# Altium project PCB_Project.PrjPcb
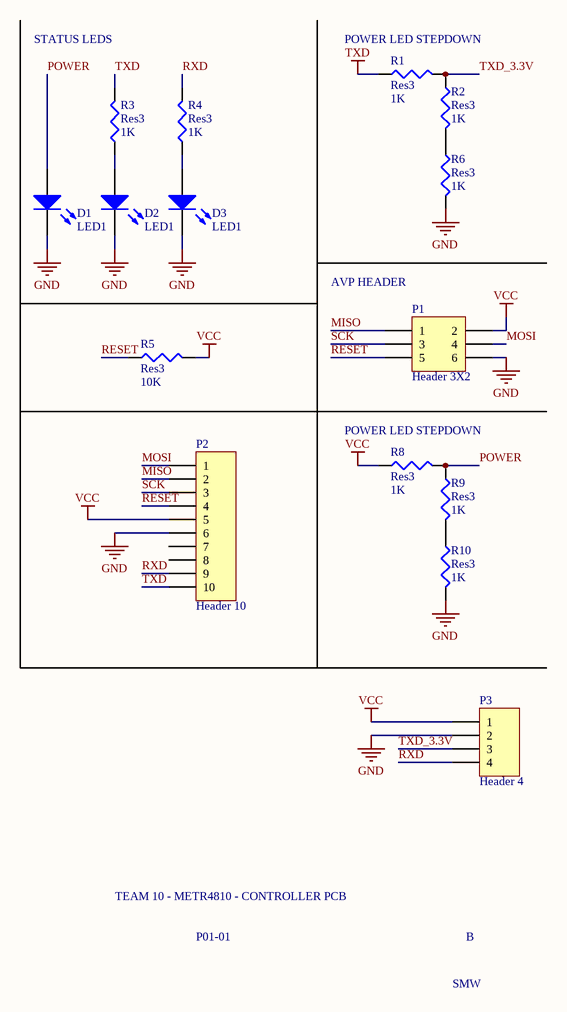
[diagram p0: Breakout_schematic.SchDoc]
1 sheet, 15 parts. Net scope: global (net labels, ports and power ports of the same name join across sheets).
Board files: Breakout_layout.PcbDoc, Breakout_layout_B.PcbDoc

## Sheet Breakout_schematic.SchDoc
size A4

### Parts
D1  LED1  [L0603]
D2  LED1  [L0603]
D3  LED1  [L0603]
P1  Header 3X2  [HDR2X3]
P2  Header 10  [HDR1X10]
P3  Header 4  [HDR1X4]
R1  Res3  value 1K  [J1-0603]
R2  Res3  value 1K  [J1-0603]
R3  Res3  value 1K  [J1-0603]
R4  Res3  value 1K  [J1-0603]
R5  Res3  value 10K  [J1-0603]
R6  Res3  value 1K  [J1-0603]
R8  Res3  value 1K  [J1-0603]
R9  Res3  value 1K  [J1-0603]
R10  Res3  value 1K  [J1-0603]

### Nets
GND: D1.2(K) D2.2(K) D3.2(K) P1.6 P2.6 P3.2 R6.2 R10.2
TXD: P2.10 R1.1 R3.2
VCC: P1.2 P2.5 P3.1 R5.2 R8.1
MISO: P1.1 P2.2
MOSI: P1.4 P2.1
POWER: D1.1(A) R8.2 R9.1
RESET: P1.5 P2.4 R5.1
RXD: P2.9 P3.4 R4.2
SCK: P1.3 P2.3
TXD_3.3V: P3.3 R1.2 R2.1
NetD2_1: D2.1(A) R3.1
NetD3_1: D3.1(A) R4.1
NetR2_2: R2.2 R6.1
NetR9_2: R9.2 R10.1

Not connected (* = marked no-connect by the designer): P2 7 8

### Notes on the sheet
- STATUS LEDS
- POWER LED STEPDOWN
- (near P1) AVP HEADER
- TEAM 10 - METR4810 - CONTROLLER PCB
- P01-01
- B
- SMW

### Library data of the parts
D1-D3 = LED1: Typical RED GaAs LED; Published: 8-Jun-2000; LatestRevisionDate: 08-Jul-2005; LatestRevisionNote: Mech Layer 1 removed.; PackageReference: LED-1; Publisher: Altium Limited; PackageDescription: LED; 2 Leads
P1 = Header 3X2: Header, 3-Pin, Dual row; LatestRevisionDate: 17-Jul-2002; LatestRevisionNote: Re-released for DXP Platform.; Publisher: Altium Limited
P2 = Header 10: Header, 10-Pin; LatestRevisionDate: 17-Jul-2002; LatestRevisionNote: Re-released for DXP Platform.; Publisher: Altium Limited
P3 = Header 4: Header, 4-Pin; LatestRevisionDate: 17-Jul-2002; LatestRevisionNote: Re-released for DXP Platform.; Publisher: Altium Limited
R1-R6 R8-R10 = Res3: Resistor; Published: 8-Jun-2000; LatestRevisionDate: 29-May-2009; LatestRevisionNote: IPC-7351 Footprint Added.; PackageReference: J1-0603; Publisher: Altium Limited; PackageDescription: Chip Resistor